# EAGLE board source_eagle (EAGLE 9.6.2)
REV: C
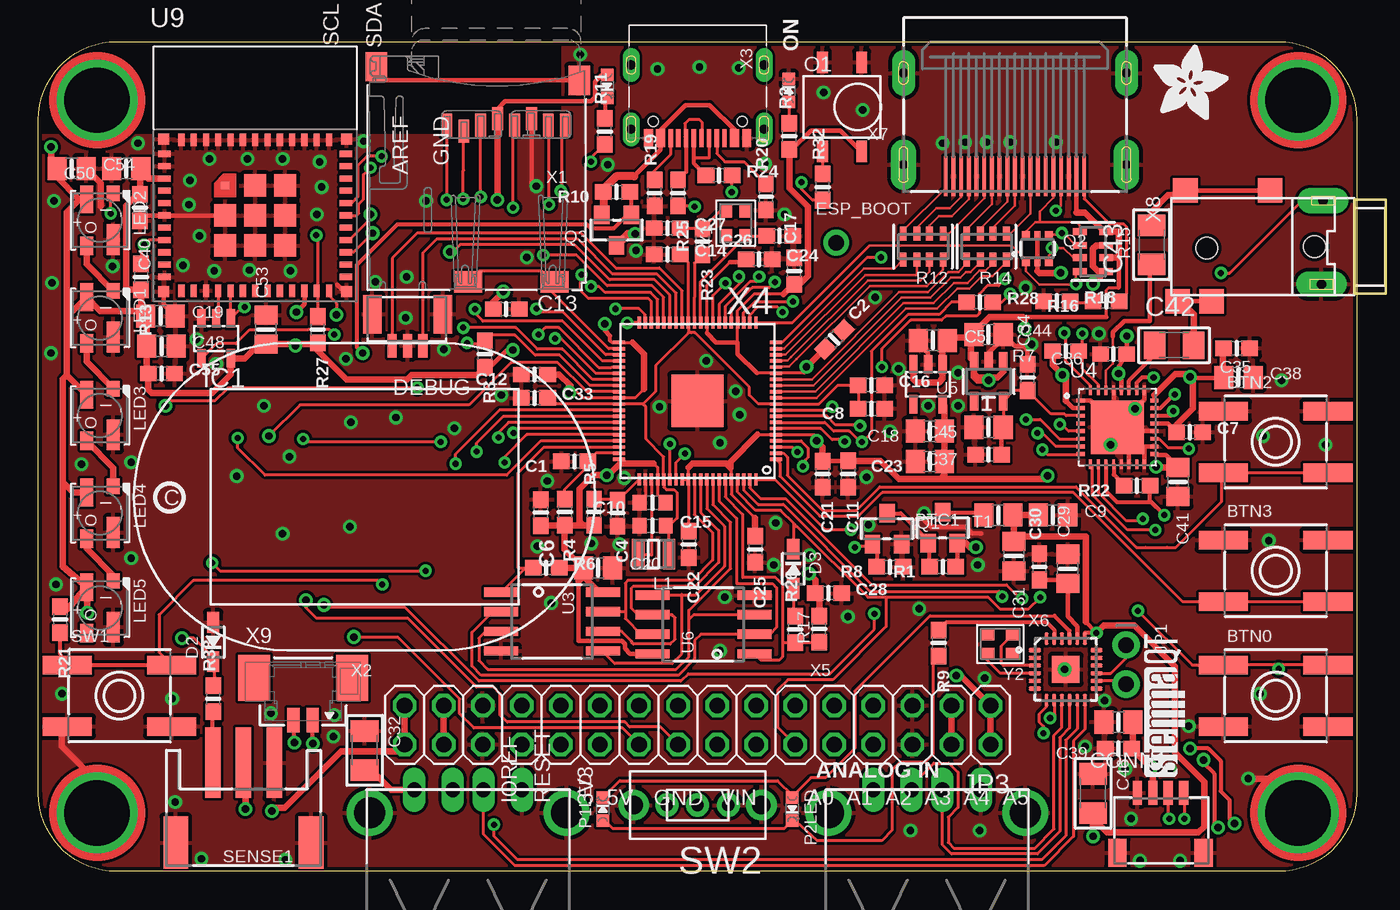
[diagram p2: board, top side]
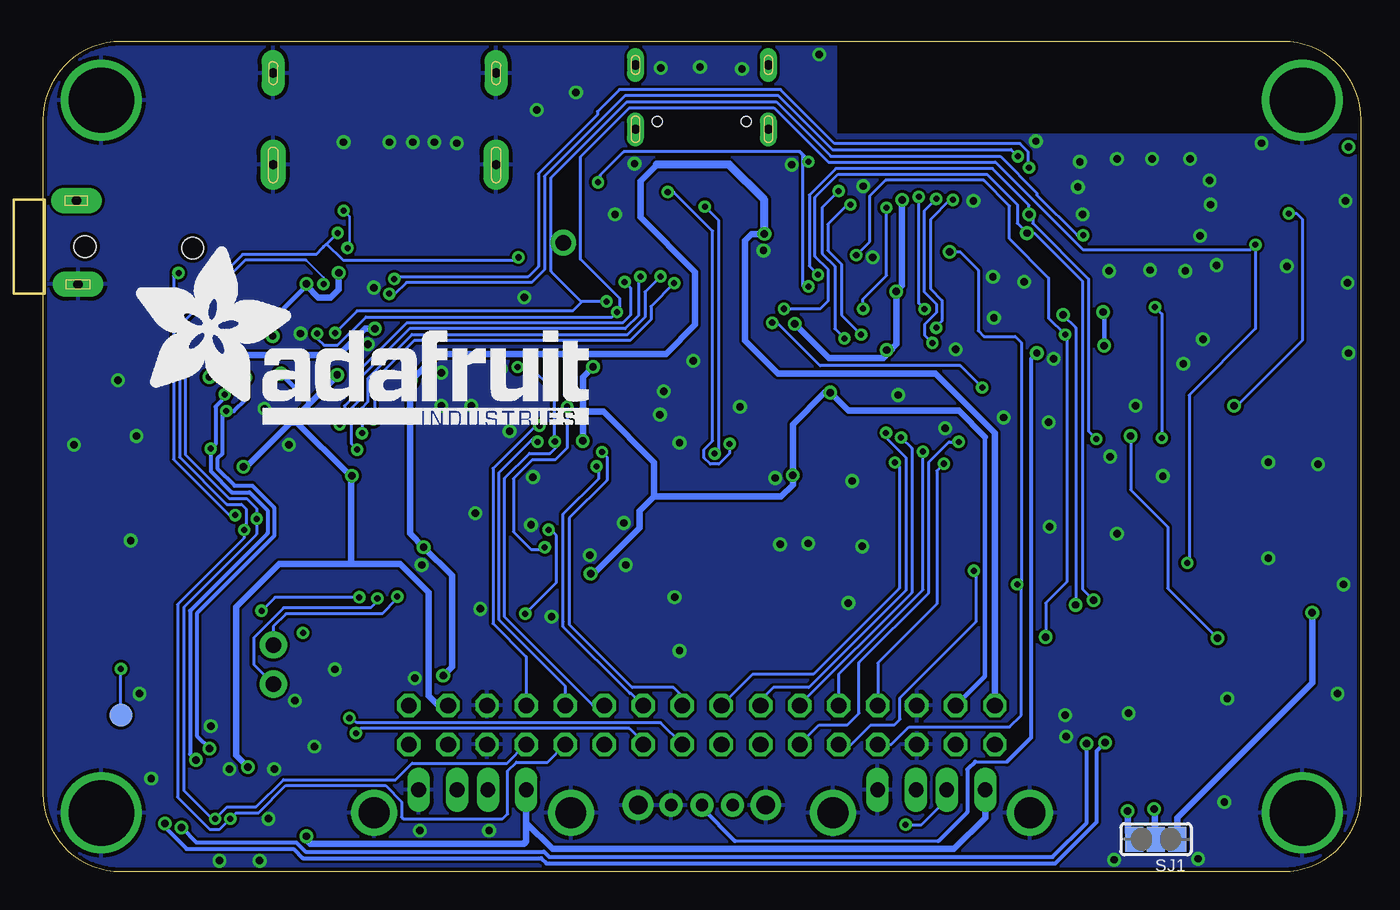
[diagram p3: board, bottom side, seen from below]

Size 85.72 x 53.98 mm. Coordinates in mm from the lower left corner, seen from the top.
Outline: 5.08,53.98 80.64,53.98 arc-90 85.72,48.9 85.72,5.08 arc-90 80.64,0 5.08,0 arc-90 0,5.08 0,48.9 arc-90 5.08,53.98
Copper layers (1*16): Top 0.035mm / dielectric 1.5mm / Bottom 0.035mm
Design rules "adafruit 7-7": minimum track width 7mil, minimum drill 15.5mil, track to track 7mil, track to pad 7mil, pad to pad 7mil, via to via 7mil, smd to smd 7mil, copper to edge 10mil, drill to drill 8mil, minimum pad ring 10mil, minimum via ring 8mil, stop-mask expansion 2mil, vias tented up to drill 20mil, thermal gap 10mil
Net classes: 3 Power: width 0.305 mm, drill 0.483 mm; 4 LOWPOWER: width 0.254 mm

## Footprints (pad centres in the part's own frame; a part is rotated, then mirrored left to right if it is on the bottom)
EVQ-Q2 = smd 3.2 x 1.2: A -3.4,-2; A' 3.4,-2; B -3.4,2; B' 3.4,2
0603-NO = smd 1.075 x 1: 1 -0.85,0; 2 0.85,0
0805-NO = smd 1.24 x 1.5: 1 -0.95,0; 2 0.95,0
0603-NO_WIDE = smd 0.9 x 1: 1 -0.85,0; 2 0.85,0
_1206 = smd 1.4 x 1.8: 1 -1.27,0; 2 1.27,0
JST_SH4 = smd 0.6 x 1.55: 1 -1.5,2.006; 2 -0.5,2.006; 3 0.5,2.006; 4 1.5,2.006 | smd 1.2 x 1.8: MT1 -2.8,-1.894; MT2 2.8,-1.894
SOD-323 = smd 1.35 x 0.8: A 1.27,0; C -1.27,0
JST_SH3_RA = smd 0.6 x 1.55: 1 1,0.924; 2 0,0.924; 3 -1,0.924 | smd 1.2 x 2.5: MT1 -2.3,-1.124; MT2 2.3,-1.124
1X01_ROUND = drill 1 pad 1.676: 1 0,0
SOT23-5L = smd 0.55 x 1.2: 1 -0.95,-1.3; 2 0,-1.3; 3 0.95,-1.3; 4 0.95,1.3; 5 -0.95,1.3
1X02_ROUND = drill 1 pad 1.778: 1 -1.27,0; 2 1.27,0
2X16 = drill 1.016 octagon: 1 -19.05,-1.27; 2 -19.05,1.27; 3 -16.51,-1.27; 4 -16.51,1.27; 5 -13.97,-1.27; 6 -13.97,1.27; 7 -11.43,-1.27; 8 -11.43,1.27; 9 -8.89,-1.27; 10 -8.89,1.27; 11 -6.35,-1.27; 12 -6.35,1.27; 13 -3.81,-1.27; 14 -3.81,1.27; 15 -1.27,-1.27; 16 -1.27,1.27; 17 1.27,-1.27; 18 1.27,1.27; 19 3.81,-1.27; 20 3.81,1.27; 21 6.35,-1.27; 22 6.35,1.27; 23 8.89,-1.27; 24 8.89,1.27; 25 11.43,-1.27; 26 11.43,1.27; 27 13.97,-1.27; 28 13.97,1.27; 29 16.51,-1.27; 30 16.51,1.27; 31 19.05,-1.27; 32 19.05,1.27
CHIPLED_0603_NOOUTLINE = smd 0.8 x 0.8: A 0,-0.75; C 0,0.75
INDUCTOR_1007 = smd 0.8 x 2: P$1 -1,0; P$2 1,0
LED3535_FULLPADS = smd 1 x 0.85: 1 -1.75,0.875 | smd 1.8 x 0.85: 2 -1.35,-0.875 | smd 1.2 x 0.85: 3 1.65,-0.875 | smd 2 x 0.85: 4 1.25,0.875
IRM-H6XXT = smd 0.7 x 1.4: 1 1.27,2.9; 2 -1.27,2.9; 3 -1.27,-2.9; 4 1.27,-2.9
SOT23-WIDE = smd 1 x 1.2: 1 -0.95,-1; 2 0.95,-1; 3 0,1
SOT363 = smd 0.5 x 0.5: 1 -0.75,-0.9; 3 0.75,-0.9; 4 0.75,0.9; 6 -0.75,0.9 | smd 0.4 x 0.5: 2 0,-0.9; 5 0,0.9
RESPACK_4X0603 = smd 0.45 x 0.9: 1 -1.3,-0.85; 2 -0.4,-0.85; 3 0.4,-0.85; 4 1.3,-0.85; 5 1.3,0.85; 6 0.4,0.85; 7 -0.4,0.85; 8 -1.3,0.85
JSTPH3 = smd 1 x 4.6: 1 -2,-2.7; 2 0,-2.7; 3 2,-2.7 | smd 1.6 x 3.4: NC1 -4.4,2.5; NC2 4.4,2.5
SOLDERJUMPER_2WAY_OPEN_NOPASTE = smd 1.168 x 1.6: 1 -1.397,0; 2 0,0; 3 1.397,0
SPDT_SS12D07VG5 = drill 1.2 pad 2: MNT1 4.15,0; MNT2 -4.15,0 | drill 0.8 pad 1.5: P 0,0; T1 -2,0; T2 2,0
TESTPOINT_ROUND_1.5MM_NO = smd 1.5 x 1.5: P$1 0,0
SMT_NUT_3MM = drill 4.25 pad 4.572: P$1 0,0
SOT23-DBV = smd 0.55 x 1.2: 1 -0.95,-1.3; 2 0,-1.3; 3 0.95,-1.3; 4 0.95,1.3; 5 -0.95,1.3
SOIC8_208MIL = smd 0.6 x 2.2: 1 -1.905,-3.315; 2 -0.635,-3.315; 3 0.635,-3.315; 4 1.905,-3.315; 5 1.905,3.315; 6 0.635,3.315; 7 -0.635,3.315; 8 -1.905,3.315
TLV320DAC3100 = smd 0.6 x 0.25: 1 -2.4,1.75; 2 -2.4,1.25; 3 -2.4,0.75; 4 -2.4,0.25; 5 -2.4,-0.25; 6 -2.4,-0.75; 7 -2.4,-1.25; 8 -2.4,-1.75; 17 2.4,-1.75; 18 2.4,-1.25; 19 2.4,-0.75; 20 2.4,-0.25; 21 2.4,0.25; 22 2.4,0.75; 23 2.4,1.25; 24 2.4,1.75 | smd 0.25 x 0.6: 9 -1.75,-2.4; 10 -1.25,-2.4; 11 -0.75,-2.4; 12 -0.25,-2.4; 13 0.25,-2.4; 14 0.75,-2.4; 15 1.25,-2.4; 16 1.75,-2.4; 25 1.75,2.4; 26 1.25,2.4; 27 0.75,2.4; 28 0.25,2.4; 29 -0.25,2.4; 30 -0.75,2.4; 31 -1.25,2.4; 32 -1.75,2.4 | smd 3.45 x 3.45: 33 0,0
SOT23-5 = smd 0.55 x 1.2: 1 -0.95,-1.3; 2 0,-1.3; 3 0.95,-1.3; 4 0.95,1.3; 5 -0.95,1.3
ESP32-PICO-MINI = smd 0.8 x 0.4: 1 -5.9,4; 2 -5.9,3.2; 3 -5.9,2.4; 4 -5.9,1.6; 5 -5.9,0.8; 6 -5.9,0; 7 -5.9,-0.8; 8 -5.9,-1.6; 9 -5.9,-2.4; 10 -5.9,-3.2; 11 -5.9,-4; 25 5.9,-4; 26 5.9,-3.2; 27 5.9,-2.4; 28 5.9,-1.6; 29 5.9,-0.8; 30 5.9,0; 31 5.9,0.8; 32 5.9,1.6; 33 5.9,2.4; 34 5.9,3.2; 35 5.9,4 | smd 0.4 x 0.8: 12 -4.8,-4.9; 13 -4,-4.9; 14 -3.2,-4.9; 15 -2.4,-4.9; 16 -1.6,-4.9; 17 -0.8,-4.9; 18 0,-4.9; 19 0.8,-4.9; 20 1.6,-4.9; 21 2.4,-4.9; 22 3.2,-4.9; 23 4,-4.9; 24 4.8,-4.9; 36 4.8,4.9; 37 4,4.9; 38 3.2,4.9; 39 2.4,4.9; 40 1.6,4.9; 41 0.8,4.9; 42 0,4.9; 43 -0.8,4.9; 44 -1.6,4.9; 45 -2.4,4.9; 46 -3.2,4.9; 47 -4,4.9; 48 -4.8,4.9 | smd 1.45 x 1.45: 49 0,0; 54 -1.95,0; 55 -1.95,-1.95; 56 0,-1.95; 57 1.95,-1.95; 58 1.95,0; 59 1.95,1.95; 60 0,1.95 | smd 0.7 x 0.7: 50 5.95,4.95; 51 5.95,-4.95; 52 -5.95,-4.95; 53 -5.95,4.95 | smd 0.5 x 0.5: 61 -1.95,1.95
MICROSD = smd 0.7 x 1.5: 1 1.761,-3.147; 2 0.661,-2.747; 3 -0.439,-3.147; 4 -1.539,-3.547; 5 -2.639,-3.147; 6 -3.739,-3.547; 7 -4.839,-3.147; 8 -5.939,-3.147 | smd 1.8 x 1.4: CD1 -5.239,7.053; CD2 0.38,7.053 | smd 1.4 x 1.9: MT1 -6.839,-6.047; MT2 6.361,-6.947
USB_TYPE_A_THM_SHORT = drill 0.95 long: D+ 1,1.5; D- -1,1.5; GND 3.5,1.5; VBUS -3.5,1.5 | drill 2 pad 3: S1 -6.4,0; S2 6.4,0
USB_C_CUSB31-CFM2AX-01-X = smd 0.575 x 1.15: A1B12 -3.2,2.275; A4B9 -2.4,2.275; B1A12 3.2,2.275; B4A9 2.4,2.275 | smd 0.275 x 1.15: A5 -1.25,2.275; A6 -0.25,2.275; A7 0.25,2.275; A8 1.25,2.275; B5 1.75,2.275; B6 0.75,2.275; B7 -0.75,2.275; B8 -1.75,2.275 | drill 0.6 pad 1 long: M1 -4.32,1.7; M2 4.32,1.7; M3 -4.32,-2.48; M4 4.32,-2.48 | hole 0.65: 2.89,1.2; -2.89,1.2
QFN80 = smd 0.78 x 0.22: 1 -5.09,3.8; 2 -5.09,3.4; 3 -5.09,3; 4 -5.09,2.6; 5 -5.09,2.2; 6 -5.09,1.8; 7 -5.09,1.4; 8 -5.09,1; 9 -5.09,0.6; 10 -5.09,0.2; 11 -5.09,-0.2; 12 -5.09,-0.6; 13 -5.09,-1; 14 -5.09,-1.4; 15 -5.09,-1.8; 16 -5.09,-2.2; 17 -5.09,-2.6; 18 -5.09,-3; 19 -5.09,-3.4; 20 -5.09,-3.8; 41 5.1,-3.8; 42 5.1,-3.4; 43 5.1,-3; 44 5.1,-2.6; 45 5.1,-2.2; 46 5.1,-1.8; 47 5.1,-1.4; 48 5.1,-1; 49 5.1,-0.6; 50 5.1,-0.2; 51 5.1,0.2; 52 5.1,0.6; 53 5.1,1; 54 5.1,1.4; 55 5.1,1.8; 56 5.1,2.2; 57 5.1,2.6; 58 5.1,3; 59 5.1,3.4; 60 5.1,3.8 | smd 0.22 x 0.78: 21 -3.8,-5.1; 22 -3.4,-5.1; 23 -3,-5.1; 24 -2.6,-5.1; 25 -2.2,-5.1; 26 -1.8,-5.1; 27 -1.4,-5.1; 28 -1,-5.1; 29 -0.6,-5.1; 30 -0.2,-5.1; 31 0.2,-5.1; 32 0.6,-5.1; 33 1,-5.1; 34 1.4,-5.1; 35 1.8,-5.1; 36 2.2,-5.1; 37 2.6,-5.1; 38 3,-5.1; 39 3.4,-5.1; 40 3.8,-5.1; 61 3.8,5.1; 62 3.4,5.1; 63 3,5.1; 64 2.6,5.1; 65 2.2,5.1; 66 1.8,5.1; 67 1.4,5.1; 68 1,5.1; 69 0.6,5.1; 70 0.2,5.1; 71 -0.2,5.1; 72 -0.6,5.1; 73 -1,5.1; 74 -1.4,5.1; 75 -1.8,5.1; 76 -2.2,5.1; 77 -2.6,5.1; 78 -3,5.1; 79 -3.4,5.1; 80 -3.8,5.1 | smd 3.4 x 3.4: MNT 0,0
QFN24_4MM = smd 0.8 x 0.28: 1 -2,1.25; 2 -2,0.75; 3 -2,0.25; 4 -2,-0.25; 5 -2,-0.75; 6 -2,-1.25; 13 2,-1.25; 14 2,-0.75; 15 2,-0.25; 16 2,0.25; 17 2,0.75; 18 2,1.25 | smd 0.28 x 0.8: 7 -1.25,-2; 8 -0.75,-2; 9 -0.25,-2; 10 0.25,-2; 11 0.75,-2; 12 1.25,-2; 19 1.25,2; 20 0.75,2; 21 0.25,2; 22 -0.25,2; 23 -0.75,2; 24 -1.25,2 | smd 1.778 x 1.778: THERM 0,0
HDMI_MOLEX_47151-0001 = smd 0.25 x 2.6: 1 4.5,3.302; 2 4,3.302; 3 3.5,3.302; 4 3,3.302; 5 2.5,3.302; 6 2,3.302; 7 1.5,3.302; 8 1,3.302; 9 0.5,3.302; 10 0,3.302; 11 -0.5,3.302; 12 -1,3.302; 13 -1.5,3.302; 14 -2,3.302; 15 -2.5,3.302; 16 -3,3.302; 17 -3.5,3.302; 18 -4,3.302; 19 -4.5,3.302 | drill 0.6 pad 1.65 long: P$1 -7.25,2.542; P$2 7.25,2.542 | drill 0.6 pad 1.5 long: P$3 7.25,-3.418; P$4 -7.25,-3.418
PJ-332A = drill 0.6 pad 1.651 long: 1 -4.792,-3; 2 -4.692,2.45 | smd 1.6 x 1.6: 3 -1.342,-3.65; 4 2.458,3.55; 5 4.158,-3.65; 6 4.658,3.55 | hole 1.4: -4.242,0; 2.758,0.1
53398-0271 = smd 0.8 x 1.6: 1 0.625,-1.27; 2 -0.625,-1.27 | smd 2.1 x 3: M1 3.185,1.48; M2 -3.185,1.48
CRYSTAL_2.5X2 = smd 0.9 x 0.75: 1 -0.825,-0.625; 2 0.825,-0.625; 3 0.825,0.625; 4 -0.825,0.625

## Placement (x,y rotation side)
BTN0  6MM_TACT  [EVQ-Q2]  80.45,11.43 0 top
BTN2  6MM_TACT  [EVQ-Q2]  80.45,27.94 0 top
BTN3  6MM_TACT  [EVQ-Q2]  80.45,19.56 0 top
C1  2.2uF  [0603-NO]  34.86,26.67 180 top
C2  1uF  [0603-NO]  51.75,34.61 45 top
C3  10uF  [0805-NO]  70.23,9.72 0 top
C4  2.2uF  [0603-NO]  37.66,23.3 270 top
C5  10uF  [0805-NO]  58.17,34.54 0 top
C6  0.1uF  [0603-NO]  32.66,23.34 270 top
C7  0.1uF  [0603-NO]  74.87,28.57 0 top
C8  0.1uF  [0603-NO]  54.17,30.1 180 top
C9  10uF  [0805-NO]  65.98,23.18 0 top
C10  10uF_0603  [0603-NO_WIDE]  39.93,23.99 180 top
C11  1uF  [0603-NO]  52.65,25.85 270 top
C12  1uF  [0603-NO]  32.26,32.32 180 top
C13  0.1uF  [0603-NO]  30.42,36.58 0 top
C14  0.1uF  [0603-NO]  40.89,40.13 0 top
C15  10uF_0603  [0603-NO_WIDE]  39.94,22.48 0 top
C16  1uF  [0603-NO]  54.17,31.62 0 top
C17  0.1uF  [0603-NO]  49.15,39.05 90 top
C18  10uF  [0805-NO]  57.98,28.64 180 top
C19  10uF  [0805-NO]  7.94,36.13 0 top
C20  10uF  [0805-NO]  36.39,19.75 0 top
C21  0.1uF  [0603-NO]  50.99,25.84 270 top
C22  0.1uF  [0603-NO]  42.29,21.27 270 top
C23  10uF  [0805-NO]  57.98,26.67 180 top
C24  0.1uF  [0603-NO]  46.86,39.81 0 top
C25  0.1uF  [0603-NO]  46.61,20.95 270 top
C26  15pF  [0603-NO]  48.2,41.34 180 top
C27  15pF  [0603-NO]  40.89,41.85 0 top
C28  1uF  [0603-NO]  51.37,18.1 0 top
C29  10uF  [0805-NO]  66.93,19.68 90 top
C30  1uF  [0603-NO]  65.09,19.81 90 top
C31  10uF  [0805-NO]  63.44,20.51 270 top
C32  100uF/6.3V  [_1206]  21.21,7.87 270 top
C33  0.1uF  [0603-NO]  32.26,30.8 0 top
C34  0.1uF  [0603-NO]  64.33,32.13 90 top
C35  0.1uF  [0603-NO]  77.91,34.04 180 top
C36  0.1uF  [0603-NO]  69.91,33.66 180 top
C37  0.1uF  [0603-NO]  61.79,27.11 180 top
C38  10uF  [0805-NO]  78.04,32.13 0 top
C39  0.1uF  [0603-NO]  70.23,8 180 top
C40  0.1uF  [0603-NO]  6.6,43.18 270 top
C41  10uF  [0805-NO]  74.1,25.34 270 top
C42  100uF/6.3V  [_1206]  73.85,34.23 0 top
C43  100uF/6.3V  [_1206]  72.39,40.77 90 top
C44  10uF  [0805-NO]  61.79,34.92 0 top
C45  10uF  [0805-NO]  61.79,28.89 180 top
C46  100uF/6.3V  [_1206]  68.58,5.08 270 top
C48  10uF  [0805-NO]  8,34.16 0 top
C50  10uF  [0805-NO]  5.71,45.72 180 top
C53  10uF  [0805-NO]  14.8,35.24 90 top
C54  10uF  [0805-NO]  2.16,45.72 0 top
C55  1uF  [0603-NO]  8,32.38 0 top
CONN1  STEMMA_I2C_QT  [JST_SH4]  72.96,3.11 0 top
D2  3.6V  [SOD-323]  11.37,14.92 90 top
D3  1N4148  [SOD-323]  49.09,19.68 270 top
DEBUG  JST_SH3  [JST_SH3_RA]  24,35.12 180 top
ESP_BOOT  [1X01_ROUND]  51.88,40.89 0 top
IC1  74AHC1G125  [SOT23-5L]  11.56,34.67 180 top
JP1  [1X02_ROUND]  70.74,13.46 270 top
JP3  2x16 SOCKET  [2X16]  42.86,9.53 180 top
L  RED  [CHIPLED_0603_NOOUTLINE]  36.98,51.05 180 top
L1  DFE252012F-3R3M=P2  [INDUCTOR_1007]  40.01,20.64 180 top
LED1  WS2812B_3535FULL  [LED3535_FULLPADS]  4,36 270 top
LED2  WS2812B_3535FULL  [LED3535_FULLPADS]  4,42.35 270 top
LED3  WS2812B_3535FULL  [LED3535_FULLPADS]  4,29.65 270 top
LED4  WS2812B_3535FULL  [LED3535_FULLPADS]  4,23.3 270 top
LED5  WS2812B_3535FULL  [LED3535_FULLPADS]  4,17.14 270 top
O1  GENERIC_IR_RECV_IRM-H6XXT  [IRM-H6XXT]  52.26,49.72 0 top
ON  GREEN  [CHIPLED_0603_NOOUTLINE]  48.79,50.8 0 top
P1LED  GREEN  [CHIPLED_0603_NOOUTLINE]  36.7,4.06 0 top
P2LED  GREEN  [CHIPLED_0603_NOOUTLINE]  49.02,4.06 180 top
PLABEL0  [PLABEL0]  49.02,52.83 0 top
PLABEL1  [PLABEL1]  36.96,53.02 0 top
PLABEL2  [PLABEL2]  73.79,47.18 0 top
PLABEL3  [PLABEL3]  16.26,15.88 0 top
PLABEL4  [PLABEL4]  80.64,23.94 0 top
PLABEL5  [PLABEL5]  80.84,15.56 0 top
PLABEL6  [PLABEL6]  80.58,7.56 0 top
PLABEL7  [PLABEL7]  77.34,1.33 90 top
PLABEL8  [PLABEL8]  5.21,7.68 0 top
PLABEL9  [PLABEL9]  23.75,13.21 90 top
PLABEL10  [PLABEL10]  26.29,13.14 90 top
PLABEL11  [PLABEL11]  28.83,12.83 0 top
PLABEL12  [PLABEL12]  31.69,12.89 0 top
PLABEL13  [PLABEL13]  34.04,12.89 0 top
PLABEL14  [PLABEL14]  36.58,12.89 0 top
PLABEL15  [PLABEL15]  39.18,12.83 0 top
PLABEL16  [PLABEL16]  41.66,12.83 0 top
PLABEL17  [PLABEL17]  44.26,12.83 0 top
PLABEL18  [PLABEL18]  46.86,12.83 0 top
PLABEL19  [PLABEL19]  49.28,12.83 0 top
PLABEL20  [PLABEL20]  51.82,12.89 0 top
PLABEL21  [PLABEL21]  53.98,12.89 0 top
PLABEL22  [PLABEL22]  56.83,12.83 0 top
PLABEL23  [PLABEL23]  59.63,12.83 0 top
PLABEL24  [PLABEL24]  62.1,12.83 0 top
PLABEL25  [PLABEL25]  45.85,0.95 0 top
PLABEL26  [PLABEL26]  39.94,0.95 0 top
PLABEL27  [PLABEL27]  22.99,16 0 top
PLABEL28  [PLABEL28]  21.27,24.7 0 top
PLABEL29  [PLABEL29]  23.24,32.64 0 top
PLABEL30  [PLABEL30]  63.56,43.12 0 top
PLABEL31  [PLABEL31]  76.14,11.49 90 top
PLABEL32  [PLABEL32]  1.02,29.46 90 top
PLABEL33  [PLABEL33]  7.24,1.4 90 top
PLABEL34  [PLABEL34]  53.47,45.34 0 top
PLABEL35  [PLABEL35]  29.02,53.21 0 top
PLABEL36  [PLABEL36]  0.95,27.24 0 bottom
PLABEL37  [PLABEL37]  63.75,21.65 0 bottom
PLABEL38  [PLABEL38]  15.88,1.21 90 bottom
PLABEL39  [PLABEL39]  9.65,1.21 90 bottom
PLABEL40  [PLABEL40]  14.99,3.49 0 bottom
PTC1  5V/1A  [0805-NO]  62.42,23.18 180 top
Q1  BSS138  [SOT23-WIDE]  55.18,22.29 0 top
Q2  BSS138 Dual  [SOT363]  64.96,40.51 0 top
Q3  DMP3098L  [SOT23-WIDE]  37.59,41.72 180 top
R1  10K  [0603-NO]  58.8,19.81 180 top
R2  10K  [0603-NO]  48.83,47.82 90 top
R3  10K  [0603-NO]  29.02,33.66 270 top
R4  220  [0603-NO]  34.23,23.37 270 top
R5  22 ohm  [0603-NO]  36.13,23.37 90 top
R6  10K  [0603-NO]  33.02,19.75 0 top
R7  10K  [0603-NO]  66.8,33.85 180 top
R8  10K  [0603-NO]  55.37,19.81 180 top
R9  5.1K  [0603-NO]  58.55,14.86 270 top
R10  10K  [0603-NO]  37.59,44.2 180 top
R11  2.2K  [0603-NO]  36.83,48.13 90 top
R12  220 Pack  [RESPACK_4X0603]  57.53,40.64 180 top
R13  10K  [0603-NO]  6.67,38.67 270 top
R14  220 Pack  [RESPACK_4X0603]  61.66,40.64 180 top
R15  10K Pack  [RESPACK_4X0603]  68.58,40.32 270 top
R16  100K  [0603-NO]  69.43,37.08 180 top
R17  10K  [0603-NO]  50.77,15.77 90 top
R18  100K  [0603-NO]  66.23,37.08 0 top
R19  5.1K  [0603-NO]  40.07,44.13 90 top
R20  5.1K  [0603-NO]  47.31,43.88 90 top
R21  10K  [0603-NO]  1.4,16.38 270 top
R22  2.2K  [0603-NO]  71.44,25.08 180 top
R23  1K  [0603-NO]  43.18,40.96 270 top
R24  22 ohm  [0603-NO]  44.26,45.28 0 top
R25  22 ohm  [0603-NO]  41.59,44.13 270 top
R26  1K  [0603-NO]  49.21,15.75 90 top
R27  10K  [0603-NO]  18.16,35.24 270 top
R28  2.2K  [0603-NO]  61.21,37.02 0 top
R32  10K  [0603-NO]  50.99,44.51 90 top
R38  1K  [0603-NO]  11.37,11.24 90 top
SENSE1  JST PH 3  [JSTPH3]  13.34,4.38 180 top
SJ1  [SOLDERJUMPER_2WAY_OPEN_NOPASTE]  13.34,2.1 180 bottom
SW1  6MM_TACT  [EVQ-Q2]  5.27,11.43 0 top
SW2  SS12D07VG5  [SPDT_SS12D07VG5]  42.86,4.32 180 top
T1  DMP3098L  [SOT23-WIDE]  58.8,22.35 0 top
TP1  [TESTPOINT_ROUND_1.5MM_NO]  80.64,10.16 0 bottom
TP2  DNP  [SMT_NUT_3MM]  3.81,50.16 0 top
TP3  SEWTAP_SMTNUTM3  [SMT_NUT_3MM]  81.92,50.16 0 top
TP4  SEWTAP_SMTNUTM3  [SMT_NUT_3MM]  81.92,3.81 0 top
TP5  SEWTAP_SMTNUTM3  [SMT_NUT_3MM]  3.81,3.81 0 top
U2  AP2112K-3.3  [SOT23-DBV]  57.85,31.69 180 top
U3  AP6404  [SOIC8_208MIL]  33.4,16.26 270 top
U4  TLV320DAC3100  [TLV320DAC3100]  70.17,28.89 0 top
U5  AP2127K-1.8  [SOT23-5]  61.79,31.88 180 top
U6  W25Q128  [SOIC8_208MIL]  43.24,16.07 90 top
U9  ESP32-C6-MINI_MINI  [ESP32-PICO-MINI]  14.1,42.67 0 top
U$72  [ADAFRUIT_5MM]  72.52,48.9 0 top
U$73  [SPEAKER_OVAL8OHM]  21.21,24.38 0 top
U$86  [STEMMAQT]  74.55,6.16 90 top
U$87  [PCBFEAT-REV-040]  8.51,24.32 0 top
U$114  [ADAFRUIT_TEXT_30MM]  79.88,29.08 0 bottom
X1  MICROSD  [MICROSD]  28.32,45.4 180 top
X2  USB_TYPEA  [USB_TYPE_A_THM_SHORT]  27.94,3.81 0 top
X3  USB Type C  [USB_C_CUSB31-CFM2AX-01-X]  42.86,49.97 180 top
X4  RP2350B  [QFN80]  42.86,30.61 180 top
X5  USB_TYPEA  [USB_TYPE_A_THM_SHORT]  57.78,3.81 0 top
X6  CH334F  [QFN24_4MM]  66.8,13.14 0 top
X7  47151-0001  [HDMI_MOLEX_47151-0001]  63.5,48.51 180 top
X8  TRRS_2SWITCH_PJ332A  [PJ-332A]  78.74,40.64 180 top
X9  CON_MOLEX_2P  [53398-0271]  17.21,11.11 0 top
Y1  12MHz_10pF_50ohm  [CRYSTAL_2.5X2]  45.34,42.16 90 top
Y2  12MHz  [CRYSTAL_2.5X2]  62.55,14.8 180 top

## Tracks (layer width: path | path; a pad name or v marks a point on that pad's centre or on a via)
1.2V
  Top 0.203: C14.2 42.26,39.61 X4.32 42.26,35.05 | 40.89,22.48 41.02,22.48 41.53,22.99 41.53,24.64 41.33,24.84 40.84,24.84 40.67,25 40.67,25.5 X4.65 40.66,26.96 39.5,28.13 39.5,30.23 39.32,30.41 | 40.89,22.48 C15.2 | L1.P$1 41.01,22.37 40.89,22.48 | C8.2 C16.1 51.98,31.62 50.77,30.41 X4.10 46.81,30.41 46.23,30.99 46.23,31.5 42.69,35.04 42.44,35.04 42.42,35.05 42.26,35.05 | 39.32,30.41 X4.51 33.5,30.41 C33.2 | 42.26,35.05 42.26,35.02 40.13,32.89 40.13,31.22 39.32,30.41
1.8V
  Top 0.203: U4.3 66.82,29.64 66.7,29.76 65.84,29.76 C34.1 63.44,31.28 U5.5 C45.1
  Top 0.305: C37.1 62.64,28.79 C45.1
3.3V  (via drill 0.48)
  Top 0.203: 44.96,39.62 43.46,38.13 X4.29 43.46,35.02 | 48.45,37.57 46.55,37.57 45.46,36.48 X4.24 45.46,34.42 | 46.61,22.99 45.06,24.53 X4.76 45.06,26.18 44.99,26.26 | X4.68 X4.69 | X4.69 42.26,22.15 | C10.1 40.26,24.51 X4.64 40.26,26.29 40.01,26.54 | 37.76,26.46 X4.60 38.03,26.54 | X4.69 42.26,26.26 | 38.62,34.41 X4.41 37.28,34.41 37.18,34.51 | 39.37,31.37 38.81,30.81 X4.50 35.4,30.81 33.89,32.32 | 46.71,32.41 X4.15 49.81,32.41 49.94,32.54 | 46.76,28.41 X4.5 50.44,28.41 50.61,28.23
  Top 0.254: 37.18,34.51 37.18,34.83 | 50.61,28.23 v50.61,28
  Top 0.305: C24.1 45.82,39.62 44.96,39.62 | C11.1 51,26.7 C21.1 | 42.26,22.15 C22.1 | 35.12,18.88 35.12,14.98 37.95,14.98 38.15,14.79 38.15,14.49 38.48,14.16 U6.8 | U4.17 72.63,27.08 73.31,27.08 C41.1 | U4.2 67.27,30.14 66.8,30.61 | 46.71,32.41 45.46,33.66 45.46,34.42 44.07,34.42 43.46,35.02 | 33.89,32.32 33.87,32.32 | 33.15,32.32 C12.1 | 37.18,34.83 36.83,35.18 v36.83,35.62 | R3.2 29.37,32.8 30.48,33.91 v30.86,33.91 | U4.28 70.42,32.22 v70.25,32.38 70.25,32.84 C36.1 70.78,33.67 v70.78,34.82 | 64.96,39.05 Q2.2 Q2.5 | O1.4 52.15,48.2 50.23,48.2 49,46.97 R2.1 | L.A 36.63,51.8 36.19,51.37 36.19,50.36 35.93,50.1 30.35,50.1 29.84,49.59 29.84,48.97 X1.4 | U9.22 17.3,36.92 v16.76,36.39 | v16.7,34.2 16.7,34.29 | v49.94,32.83 49.94,32.54
  Top 0.406: R15.7 68.79,40.72 68.58,40.51 68.58,39.37 68.93,39.02 R15.5 69.38,39.02 v68.58,38.23 | 48.45,37.57 49.09,38.2 C17.1 49.53,38.2 50.04,38.71 50.04,43.24 48.83,44.45 R2.1 | C25.1 46.61,22.99 | R5.1 35.43,22.52 | 35.43,22.52 R4.2 | 35.43,22.52 35.18,22.77 35.18,24.89 36.07,25.78 v36.96,25.78 37.08,25.78 37.76,26.46 | U3.8 36.65,18.22 36.41,18.22 35.44,19.2 | 42.26,26.26 42.55,26.54 44.7,26.54 44.99,26.26 44.99,26.64 46.76,28.41 | 38.03,26.54 40.01,26.54 | C41.1 72.68,26.29 v72.68,26.33 | 66.8,30.61 66.8,32.08 v66.58,32.29 65.95,32.93 R7.2 | 1.84,36.07 LED1.2 4.03,36.45 6.67,36.45 C19.1 | 1.84,32.29 LED3.2 | 1.84,36.07 1.84,32.29 | LED4.2 2.27,24.65 1.59,25.34 | 1.59,25.34 1.59,32.03 1.84,32.29 | LED5.2 1.59,19.84 1.59,25.34 | 38.62,34.41 39.37,33.66 39.37,31.37 | X1.4 29.84,48.93 v29.84,43.69 | v30.23,37.72 30.23,37.68 29.57,37.02 C13.1 | C11.1 54.77,26.7 55.94,25.53 58.67,25.53 | 58.67,25.53 58.92,25.78 C23.1 C18.1 58.92,30.26 U2.5 | LED5.2 1.91,17.08 1.55,17.08 R21.1 | C21.1 50.99,27.62 v50.61,28 | v34.51,31.15 34.51,31.53 34.59,31.6 33.87,32.32 33.15,32.32 | 58.67,25.53 65.41,25.53 v65.63,25.74 | C3.2 71.18,8.1 C39.1 72.29,6.79 v72.39,6.79 72.46,6.72 CONN1.2 | v66.48,38.92 65.09,38.92 64.96,39.05 | 16.7,34.29 18.06,34.29 R27.2 18.16,33.88 20.04,32 23.96,32 24.26,32.3 28.51,32.3 R3.2 | C19.1 7.05,36.07 C48.1 7.05,32.48 C55.1 7.15,31.33 7.37,31.11 11.3,31.11 12.51,32.32 IC1.5 13.4,33.37 14.32,34.29 C53.1 16.61,34.29 v16.7,34.2 | C19.1 6.67,36.45 R13.2 6.64,37.85 5.71,37.85 5.71,43.31 6.44,44.03 C40.1 6.6,45.59 6.73,45.47 | LED2.2 2.65,43.7 | 2.65,43.7 1.14,45.21 1.14,45.65 C54.1 0.83,46.1 v0.83,47.12
  Top 0.406: C50.1 6.73,45.65 6.73,45.47 | U9.3 7.12,45.07 6.73,45.47 | JP3.30 JP3.29 | JP3.3 JP3.4 | 1.84,36.07 1.84,42.9 2.65,43.7 | C20.1 35.44,19.2 | 35.44,19.2 35.12,18.88 | C20.1 34.23,20.96 R4.2 | R6.2 C20.1 | C6.2 34.2,22.49 R4.2 | v3.17,16.83 3.17,18.45 LED5.2 | v50.1,19.37 50.52,18.95 C28.1 50.77,17.84 R17.2 | C2.1 49.97,32.83 v49.94,32.83
  Bottom 0.305: v70.25,32.38 68.39,30.52 | v30.86,33.91 30.54,33.91 30.51,33.94 30.54,33.97 | v70.78,34.82 70.78,35.9 68.58,38.1 | 24.45,28.26 24.45,12.7 JP3.29 | v16.7,34.2 16.7,36.32 v16.76,36.39
  Bottom 0.406: 45.97,24.38 37.72,24.38 36.96,25.15 v36.96,25.78 36.96,29.08 34.89,31.15 v34.51,31.15 33.34,29.97 26.16,29.97 24.45,28.26 | v72.68,26.33 72.47,26.33 69.6,29.21 | 69.6,29.21 68.39,30.42 | 68.39,30.42 66.55,32.26 v66.58,32.29 | 68.39,30.52 68.39,30.42 | 65.66,20 70.36,20 73.15,17.21 73.15,7.56 v72.39,6.79 | 65.66,20 65.66,25.65 65.88,25.88 | 69.6,29.21 69.22,29.21 65.88,25.88 | v50.1,19.37 49.91,19.37 46.93,22.35 46.93,23.43 45.97,24.38 | v29.84,43.69 29.84,38.1 v30.23,37.72 30.23,34.29 30.54,33.97 | v36.83,35.62 34.61,33.4 31.05,33.4 30.51,33.94 | v49.94,32.83 50.61,32.16 50.61,29.91 | 50.61,29.91 v50.61,28 | v65.63,25.74 65.76,25.88 65.88,25.88 | 45.97,24.38 45.97,26.61 49.28,29.91 50.61,29.91 | v68.58,38.23 68.58,38.1 67.82,37.34 66.99,37.34 66.48,37.85 v66.48,38.92 | JP3.3 60.01,10.79 60.64,11.43 60.64,18.16 62.48,20 65.66,20 | SJ1.1 11.94,3.49 3.17,12.26 v3.17,16.83
5.0V  (via drill 0.48)
  Top 0.203: 69.43,36.07 69.43,37.81 69.6,37.97 70.23,37.97
  Top 0.254: U4.24 72.57,30.98
  Top 0.305: 74.9,32.09 75.06,32.09 77.09,32.09 C38.1 | U4.21 73.45,29.14 C7.1 | T1.2 59.75,19.91 R1.1 | 59.31,34.73 C5.2 59.12,34.38 | X7.18 67.5,42.86 | 70.26,39.92 70.26,38 70.23,37.97 | 69.43,36.07 64.01,36.07
  Top 0.406: C38.1 76.99,32.25 C35.2 | 74.9,32.09 v74.9,32.16 74.71,32.35 73.95,32.35 72.57,30.98 | C7.1 74.02,29.07 75.06,30.11 75.06,32.09 | 60.65,34.73 60.65,33.37 U5.3 | U5.1 62.74,32.51 62.36,32.13 61.09,32.13 60.84,32.38 U5.3 | U5.3 60.84,32.16 61.06,31.94 v61.78,31.94 | T1.2 60.31,21.35 60.58,21.08 v60.96,21.08 | v64.14,35.31 64.14,35.94 64.01,36.07 61.85,36.07 60.84,35.05 C44.1 60.84,34.73 60.65,34.73 | U2.3 56.9,32 57.09,31.81 58.55,31.81 58.8,32.06 U2.1 58.8,34.07 59.12,34.38 | 59.31,34.73 60.65,34.73 | 67.5,42.86 68.06,42.86 69.3,41.62 R15.8 70.26,41.62 70.26,39.92 R15.6 | JP3.31 JP3.32 23.37,7.81 19.68,7.81 16,4.13 15.37,4.13 v15.18,3.94 | JP3.2 JP3.1 59.97,12.74 v59.69,12.74
  Top 0.508: v38.8,41.47 38.34,41.47 Q3.3
  Bottom 0.406: 45.79,45.98 46.86,44.91 46.86,42.55 43.31,38.99 43.31,35.56 45.21,33.66 60.07,33.66 v61.78,31.94 61.85,31.88 61.85,21.97 v60.96,21.08 59.12,19.24 59.12,13.31 v59.69,12.74 | v74.9,32.16 74.83,32.16 73.41,33.59 66.48,33.59 64.77,35.31 v64.14,35.31 | v38.8,41.47 39.62,41.47 40.07,41.02 40.07,34.54 37.91,32.38 27.69,32.38 23.81,28.51 JP3.31 | v15.18,3.94 15.18,2.54 SJ1.3
  Bottom 0.508: v38.8,41.47 38.8,43.69 41.09,45.98 45.79,45.98
!RESET  (via drill 0.39, 0.48)
  Top 0.203: X4.35 41.06,37.49 40.07,38.48 37.15,38.48 34.86,40.77 27.43,40.77 26.97,40.3 v26.75,40.3 | SW1.B' 7.84,14.26 7.84,16.69 10.08,18.92 22.1,18.92 v22.36,18.67
  Top 0.254: R21.2 1.4,14.15 SW1.B SW1.B'
  Bottom 0.203: v26.75,40.3 26.09,40.3 24.89,39.11 24.89,35.18 24.51,34.8 22.48,34.8 22.1,34.42 22.1,18.67 | JP3.26 30.54,8.26 29.4,9.4 22.86,9.4 22.1,10.16 22.1,18.67 | v22.36,18.67 22.1,18.67
A0  (via drill 0.48)
  Top 0.203: X4.49 35.67,31.21 33.77,33.1 30.75,33.1 28,30.35 17.02,30.35 v14.99,28.32 | v9.34,15.18 10.1,15.18 11.43,13.84 11.43,12.15 R38.2 11.5,12.13 D2.C
  Bottom 0.203: v14.99,28.32 14.99,24.83 12.57,22.42 12.57,18.41 v9.34,15.18
A0_JST1
  Top 0.254: R38.1 11.34,10.29 SENSE1.3
A1  (via drill 0.39)
  Top 0.203: X4.52 29.97,30.01 27.13,27.16 v27.13,26.52
  Bottom 0.203: v27.13,26.52 27.6,26.05 27.6,17.39 31.43,13.56 JP3.25
A2  (via drill 0.39)
  Top 0.203: X4.53 30.24,29.61 28.49,27.85 v28.49,27.3
  Bottom 0.203: v28.49,27.3 28.49,18.32 32.99,13.81 33.97,12.83 JP3.23
A3  (via drill 0.39)
  Top 0.203: X4.54 30.57,29.21 29.91,28.55 v29.91,28.23
  Bottom 0.203: v29.91,28.23 29.21,27.53 29.21,18.13 36.39,10.96 36.39,10.92 JP3.21
A4  (via drill 0.39)
  Top 0.203: X4.55 31.17,28.81 v30.89,28.53
  Bottom 0.203: v30.89,28.53 30.89,28.21 29.59,26.91 29.59,18.29 35.92,11.96 38.21,11.96 39.06,11.11 39.05,11.1 JP3.19
A5  (via drill 0.39)
  Top 0.203: X4.56 31.75,28.41 30.32,26.97 v30.32,26.61
  Bottom 0.203: v30.32,26.61 30.04,26.33 30.04,18.41 35.62,12.83 39.56,12.83 JP3.17
ADC_AVDD
  Top 0.203: X4.59 36.25,27.21 C1.1 35.71,26.34 34.23,24.85 R4.1
BUTTON2
  Top 0.203: BTN3.A' BTN3.A 74.39,17.56 71.12,20.83 71.03,20.92 67.31,24.64 54.86,24.64 53.34,23.11 50.81,23.11 48.21,25.72 48.21,26.55 X4.1
BUTTON3
  Top 0.203: X4.2 48.45,27.21 48.7,26.95 48.7,25.76 50.97,23.5 53.18,23.5 54.71,25.02 67.47,25.02 71.41,21.08 72.01,21.08 73.41,21.08 73.98,21.08 76.92,24.02 76.92,25.8 BTN2.A BTN2.A'
CC1
  Top 0.203: X3.A5 44.11,46.69 44.64,46.16 45.87,46.16 R20.2
CC2
  Top 0.203: X3.B5 41.11,46.64 39.76,45.29 R19.2
D6  (via drill 0.39)
  Top 0.203: X4.3 49.03,27.61 v49.36,27.28
  Bottom 0.203: v49.36,27.28 49.04,26.96 49.04,25.44 51.5,22.98 51.5,16.07 47.4,11.96 44.72,11.96 44.13,11.38 JP3.15
D7  (via drill 0.39)
  Top 0.203: X4.4 49.59,28.01 50.04,27.56 50.04,26.92 49.72,26.61 v49.72,26.35
  Bottom 0.203: v49.72,26.35 49.59,26.23 49.59,25.53 51.88,23.24 51.88,16.26 51.88,15.91 47.55,11.58 47.46,11.58 JP3.13
D8/TX1  (via drill 0.39)
  Top 0.203: v52.43,27.96 52.3,28.08 51.6,28.08 50.88,28.81 X4.6 | U9.30 20.7,42.67 20.83,42.8 20.83,43.4 21.14,43.72 21.14,45.34 v21.59,45.78 | v62.87,38.54 62.42,38.1 61.71,38.1 61.18,37.57 61.18,36.29 61.02,36.13 59.02,36.13 58.73,35.85 56.71,35.85 54.86,34 v54.86,32.81
  Bottom 0.203: JP3.11 49.94,10.79 55.69,16.54 55.69,25.58 54.08,27.19 52.75,27.19 52.37,27.57 52.37,27.89 v52.43,27.96 52.49,27.96 52.49,31.28 54.13,32.92 54.75,32.92 v54.86,32.81 | v21.59,45.78 21.64,45.83 21.64,46.8 22.18,47.34 34.23,47.34 37.75,50.86 48.23,50.86 49.66,49.43 49.66,49.21 53.49,45.38 53.49,39.34 54.14,38.7 62.72,38.7 v62.87,38.54
D9/RX1  (via drill 0.39)
  Top 0.203: X4.7 51.14,29.21 51.71,28.64 52.72,28.64 53.51,27.86 53.57,27.92 | 53.57,27.92 v53.55,27.94 | R28.1 59.37,37.02 58.58,36.23 56.55,36.23 54.17,33.85 54.17,28.51 53.6,27.95 53.57,27.92
  Bottom 0.203: v53.55,27.94 53.8,28.2 56.07,25.93 56.07,16.38 51.75,12.06 JP3.9
D10  (via drill 0.39)
  Top 0.203: v53.43,28.98 53.43,29.05 51.84,29.05 51.28,29.61 X4.8
  Bottom 0.203: v53.43,28.98 53.69,28.98 56.45,26.22 56.45,16.13 54.29,13.97 JP3.7
D+  (via drill 0.39)
  Top 0.203: X4.67 41.46,26.6 v42.04,27.18 | v42.67,43.24 42.63,43.28 R25.2
  Bottom 0.203: v42.04,27.18 41.78,27.43 41.78,42.35 v42.67,43.24
D+1
  Top 0.203: X6.12 68.05,9.25 67.31,8.51 67.31,2.29 65.41,0.38 30.99,0.38 28.94,2.43 X2.D+
D+2
  Top 0.203: X6.10 67.05,9.33 66.42,8.7 66.42,2.6 64.96,1.14 59.37,1.14 58.78,1.73 X5.D+
D+3  (via drill 0.4)
  Top 0.203: v65.79,9.98 65.92,9.98 66.1,10.16 66.1,11.09 X6.8
  Bottom 0.203: JP3.16 45.55,9.68 65.3,9.68 65.61,9.98 v65.79,9.98
D-  (via drill 0.39)
  Top 0.203: X4.66 v41.06,27.81 | v45.09,44.2 45.09,45.25 R24.2
  Bottom 0.203: v41.06,27.81 41.06,27.2 41.76,26.5 42.32,26.5 42.72,26.9 42.72,27.46 42.16,28.01 42.16,41.66 44.7,44.2 v45.09,44.2
D-1  (via drill 0.39)
  Top 0.203: X6.11 67.55,9.29 66.8,8.54 66.8,2.32 65.25,0.76 31.15,0.76 29.62,2.29 v29.62,3.05
  Bottom 0.203: v29.62,3.05 28.57,3.05 26.8,4.83 26.8,5.17 X2.D-
D-2
  Top 0.203: X5.D- 56.78,5.6 58.23,7.05 59.2,7.05 59.79,6.46 59.79,4.16 59.17,3.54 59.17,1.89 59.53,1.52 64.8,1.52 66.04,2.76 66.04,8.86 66.55,9.37 X6.9
D-3  (via drill 0.4)
  Top 0.203: v65.36,8.99 65.36,9.44 65.1,9.7 65.1,10.26 65.55,10.71 X6.7
  Bottom 0.203: JP3.14 46.67,8.39 47.58,9.3 65.06,9.3 v65.36,8.99
ESP_BUSY  (via drill 0.39, 0.48)
  Top 0.203: X4.80 47.88,25.51 51.16,22.23 v52.83,22.23 | v54.36,16.76 54.36,15.75 51.46,12.86 42.26,12.86 41.78,12.38 28.64,12.38 23.84,17.18 18.71,17.18 v18.55,17.34 | U9.24 18.9,37.45 19.39,36.97 v19.39,36.2 v19.38,36.2
  Bottom 0.203: v54.36,16.76 52.32,18.8 52.32,21.84 52.7,22.23 v52.83,22.23 | v19.38,36.2 18.55,35.37 v18.55,17.34
ESP_CS  (via drill 0.39)
  Top 0.203: X4.57 37.26,28.02 37.25,28.03 32.7,28.03 30.45,25.78 14.73,25.78 12.95,27.56 v12.95,28.19 | U9.16 12.5,35.98 IC1.1 13.24,36.71 v13.4,36.71
  Bottom 0.203: v13.4,36.71 12.95,36.26 v12.95,28.19
ESP_MISO
  Top 0.203: U9.15 11.7,36.11 IC1.2
ESP_TX  (via drill 0.39)
  Top 0.203: v22.32,46.52 21.36,46.52 20.77,45.92 20.77,43.88 20.36,43.47 U9.31 | R28.2 62.65,37.02 v63.2,37.57
  Bottom 0.203: v22.32,46.52 22.76,46.96 34.39,46.96 37.91,50.48 47.85,50.48 53.11,45.22 53.11,39.14 53.94,38.32 62.08,38.32 62.82,37.57 v63.2,37.57
GND  (via drill 0.48)
  Top 0.203: X4.62 39.46,24.37
  Top 0.254: 70.42,28.64 U4.33 | 39.46,24.37 C10.2
  Top 0.305: 61.32,22 60.74,22 60.33,22.42 58.04,22.42 57.59,22.86 v57.59,23.3 | U4.29 69.92,29.14 | 69.92,29.14 U4.33 | U4.20 70.42,28.64 71.42,27.64 71.82,27.64 | U4.18 71.82,27.64 | U4.16 71.92,27.54 71.82,27.64 | U4.14 70.92,28.14 U4.33 | U4.1 68.42,30.64 69.92,29.14 | U4.33 71.31,30.04 v71.31,30.1 71.92,30.71 U4.25 | U5.2 61.78,33.72 62.74,34.67 C44.2 63.5,34.16 64.07,34.16 64.33,33.91 C34.2 | U2.2 57.85,33.72 57.22,34.35 C5.1 | C40.2 6.95,42.67 U9.6 U9.54 | C19.2 8.15,36.87 U9.52 | X1.6 32.06,44.58 v32.38,44.58 | X1.MT2 21.96,51.45 X1.MT1 | U9.51 19.88,37.72 19.43,38.17
  Top 0.406: TP5.P$1 3.81,5.84 1.52,8.13 1.52,8.75 SW1.A | TP4.P$1 81.92,4.25 80.14,6.03 v78.68,6.03 | C54.2 4.06,44.77 4.06,43.27
  other vias: 37.78,21.27 35.94,21.34 47.82,19.94 40.39,30.23 44.32,27.88 45.59,29.72 45.34,31.24 43.43,33.21 42.99,52.32 38.86,40.39 48.51,42.74 47.24,46.04 21.15,47.5 25.21,43.62 35.24,53.15 31.75,39.94 23.94,38.67 30.1,30.99 53.98,22.54 61.09,19.94 53.85,25.65 69.72,27.75 79.63,28.32 80.84,31.94 59.82,30.29 59.82,32.45 57.85,30.29 80.01,21.53 83.69,27.75 66.74,13.14 33.08,25.4 32.45,21.15 44.64,17.84 58.8,47.37 60.26,47.43 61.66,47.43 63.18,47.43 66.17,47.43 45.53,52.26 40.26,52.2 38.1,25.59 21.91,38.35 23.88,36 57.28,17.08 52.64,16.57 9.84,44.96 11.11,46.35 13.59,46.35 15.88,46.35 18.29,46.16 18.41,44.51 18.1,42.74 16.38,39.05 13.72,39.12 11.43,39.05 9.4,39.43 10.48,41.34 9.78,43.37 4.83,39.37 1.02,43.62 0.89,38.29 6.48,47.37 0.83,33.72 2.79,26.48 1.14,18.67 6.03,20.38 6.03,26.61 14.67,30.29 16.32,26.99 71.06,3.43 71.63,0.7 74.23,0.7 54.42,37.34 47.94,22.67 50.16,20.57 10.29,34.61 11.56,33.02 37.02,45.97 73.6,6.67 70.68,6.67 61.21,2.67 56.71,2.67 61.53,12.57 68.07,8.13 69.34,11.11 74.8,9.46 79.44,11.56 33.34,17.46 44.32,14.35 19.18,8.76 19.24,10.16 15.11,10.29 8.7,11.24 10.6,0.83 16.07,0.76 8.89,4.51 1.52,11.56 15.88,21.97 12.89,25.72 20.32,29.21 20.26,22.42 23.24,29.53 27.05,28.83 20,33.34 26.35,33.97 55.37,28.64 55.94,32.7 64.2,37.97 68.96,34.99 64.58,34.29 51.05,50.67 53.59,49.53
  pour Top: 0,47.88 34.1,47.88 34.1,53.98 85.66,53.98 85.66,0 0,0
  pour Bottom: 0,47.88 34.16,47.88 34.16,53.91 85.72,53.91 85.72,53.66 85.66,47.88 85.66,0 0,0
HDMI_TX0+
  Top 0.178: R14.4 60.36,41.76 62,43.4 X7.7
HDMI_TX0-
  Top 0.178: R14.3 61.26,41.83 63,43.57 X7.9
HDMI_TX1+
  Top 0.178: R12.2 57.93,42 58.57,42.63 59.39,42.63 60.5,43.74 X7.4
HDMI_TX1-
  Top 0.178: X7.6 61.5,43.78 59.21,41.49 R12.1
HDMI_TX2+
  Top 0.178: X7.1 59,44.45 56.23,41.68 R12.4
HDMI_TX2-
  Top 0.178: R12.3 57.13,41.87 58.4,43.14 59.27,43.14 60,43.87 X7.3
HDMI_TXC+
  Top 0.178: R14.2 62.06,41.87 63.5,43.31 X7.10
HDMI_TXC-
  Top 0.178: X7.12 64.5,42.78 63.21,41.49 R14.1
HOTPLUG
  Top 0.203: X7.19 68,43.76 69.63,42.13 70.57,42.13 70.74,41.95 70.74,37.55 R16.1
HOTPLUG_3V
  Top 0.203: R18.2 67.21,36.96 68.45,36.96 R16.2
HSTX12
  Top 0.178: R14.8 62.96,39.62 62.95,39.62 62.04,38.72 61.34,38.72 60.55,37.92 59.75,37.92 58.42,36.6 56.4,36.6 50.6,30.81 X4.11
HSTX13
  Top 0.178: X4.12 47.98,31.23 50.52,31.23 56.25,36.96 58.21,36.96 59.53,38.28 60.4,38.28 61.2,39.07 61.59,39.07 62.06,39.54 R14.7
HSTX14
  Top 0.178: R14.6 61.26,39.64 60.61,38.99 60.32,38.99 59.96,38.63 59.32,38.63 58,37.31 56.1,37.31 50.4,31.61 X4.13
HSTX15
  Top 0.178: R14.5 60.36,39.53 59.82,38.99 59.18,38.99 57.86,37.67 55.96,37.67 50.3,32.01 X4.14
HSTX16
  Top 0.178: X4.16 47.98,32.83 48.82,32.83 49.3,33.31 49.3,33.32 54.07,38.09 57.77,38.09 58.83,39.15 R12.8
HSTX17
  Top 0.178: X4.17 47.98,33.23 48.72,33.23 48.95,33.46 48.95,33.47 53.93,38.44 57.37,38.44 57.93,39.01 R12.7
HSTX18
  Top 0.178: X4.18 48.59,33.61 53.78,38.8 57.09,38.8 57.13,38.84 R12.6
HSTX19
  Top 0.178: X4.19 48.48,34.01 53.69,39.21 55.65,39.21 R12.5
I2S_BCLK  (via drill 0.39)
  Top 0.203: v64.97,28.5 65.28,28.5 66.15,27.64 U4.7 | v45.56,38.7 45.81,38.45 44.26,36.9 X4.27
  Bottom 0.203: v64.97,28.5 64.97,30.16 64.59,30.54 64.59,32.06 61.72,34.92 47.69,34.92 46.57,36.05 46.57,37.7 v45.56,38.7
I2S_DIN  (via drill 0.39)
  Top 0.203: U4.5 66.99,28.64 66.55,29.08 v66.42,29.08 | X4.25 45.06,36.62 46.4,37.97 47.51,37.97 v47.89,38.35
  Bottom 0.203: v66.42,29.08 66.1,29.4 66.1,30.29 65.41,30.99 65.41,32.32 62.04,35.69 48.01,35.69 47.51,36.19 47.51,37.97 v47.89,38.35
I2S_ESP_IRQ  (via drill 0.39)
  Top 0.203: X4.23 45.86,36.34 46.6,37.08 v49.07,37.08 | v66.71,35.03 66.78,34.96 66.78,33.23 68.38,31.63 68.38,31.33 U4.32 | U9.23 18.16,37.71 | 18.16,37.71 R27.1 | v18.07,41.38 18.16,41.29 18.16,37.71
  Bottom 0.203: v66.71,35.03 65.29,36.45 51.29,36.45 50.66,37.08 v49.07,37.08 50.72,37.08 52.67,39.02 52.67,40.83 | 52.67,40.83 52.67,45.12 47.74,50.05 38.02,50.05 34.49,46.52 23.47,46.52 21.08,44.13 21.08,44.01 18.46,41.38 v18.07,41.38 | ESP_BOOT.1 52.6,40.89 52.67,40.83
I2S_LRCLK  (via drill 0.39)
  Top 0.203: X4.28 43.86,37.46 v44.67,38.27 | v64.22,29.4 65.14,29.4 66.4,28.14 U4.6
  Bottom 0.203: v44.67,38.27 46.19,36.75 46.19,35.89 47.53,34.54 61.57,34.54 64.16,31.95 64.16,29.46 v64.22,29.4
I2S_MCLK  (via drill 0.39)
  Top 0.203: X4.26 44.66,36.76 46.29,38.39 46.87,38.39 v46.87,38.69 | v65.28,27.44 65.6,27.13 67.56,27.13 67.75,27.13 U4.8
  Bottom 0.203: v46.87,38.69 47,38.55 47,36.16 47.85,35.31 61.88,35.31 65.02,32.16 65.02,30.75 65.67,30.11 65.67,27.82 v65.28,27.44
IRIN
  Top 0.203: O1.3 R32.2
LED  (via drill 0.39, 0.4)
  Top 0.203: R11.1 36.75,47.2 36.73,47.21 35.94,46.42 v35.94,46.16 | X4.37 40.26,37.21 39.81,37.66 36.85,37.66 36.45,38.06 v35.94,38.06 | v49.62,44.83 49.62,44.39 50.34,43.66 R32.1
  Bottom 0.203: v35.94,38.06 36.28,38.06 36.28,46.57 36.53,46.82 | v35.94,46.16 35.94,46.29 36.47,46.82 36.53,46.82 | 36.53,46.82 47.95,46.82 49.49,45.28 49.49,44.96 v49.62,44.83
LX
  Top 0.203: X4.63 39.87,25.5 39.87,25 39.88,25 39.88,20.57 39.07,20.57 L1.P$2
MICDET  (via drill 0.39)
  Top 0.203: v76.9,38.92 77.47,38.92 82.18,43.64 X8.1
  Top 0.254: U4.11 69.42,24.75 70.17,24 72.39,24 v73.22,23.18 72.29,24.11 R22.1
  Bottom 0.203: v73.22,23.18 73.6,23.18 77.22,26.8 77.22,38.73 77.03,38.92 v76.9,38.92
MISO  (via drill 0.39, 0.48)
  Top 0.203: X4.36 40.66,37.35 39.91,38.1 36.99,38.1 35,40.09 v32.83,40.09 | IC1.4 11.56,34.32 12.83,34.32 13.75,35.24 17.53,35.24 17.56,35.28 18.89,35.28 v19.24,34.92 | JP3.20 37.97,9.34 28.32,9.34 27.39,10.26 27.39,11.23 23.37,15.25 v20.51,15.25
  Bottom 0.203: v32.83,40.09 31.94,40.98 31.94,43.94 30.92,44.96 24.54,44.96 22.86,43.28 22.86,41.15 20.32,38.61 20.32,36.01 v19.24,34.92 19.13,34.81 19.13,18.85 20.51,17.46 v20.51,15.25
MISO/SDIO_DAT0  (via drill 0.39)
  Top 0.203: X1.7 33.16,43.42 v33.21,43.37 | v32.51,34.92 32.96,35.37 33.85,35.37 36.44,32.79 37.25,32.79 37.26,32.8 37.75,32.8 X4.45
  Bottom 0.203: v33.21,43.37 33.4,43.37 34.67,42.1 34.67,40.39 33.78,39.5 33.78,36.2 v32.51,34.92
MOSI  (via drill 0.39, 0.48)
  Top 0.203: X4.39 39.45,36.21 39.07,36.6 v37.53,36.6 | v21.73,41.52 20.48,40.27 U9.27 | JP3.18 40.45,9.4 38.45,9.4 38.13,9.72 30.48,9.72 30.04,10.16 30.04,11.56 29.59,12 28.48,12 24,16.48 18.06,16.48 17.4,17.15 v17.4,17.65
  Bottom 0.203: v37.53,36.6 35.16,36.6 34.64,37.12 34.64,39.15 35.5,40.01 35.5,43.85 34.01,45.34 24.32,45.34 22.36,43.38 22.36,42.15 v21.73,41.52 21.24,41.52 18.11,38.39 18.11,18.36 v17.4,17.65
MOSI/SDIO_CMD  (via drill 0.39)
  Top 0.203: X4.44 36.68,33.21 34.09,35.8 28.91,35.8 28.38,36.32 v28.38,36.58 | v28.77,43.88 X1.3
  Bottom 0.203: v28.38,36.58 28.77,36.96 v28.77,43.88
N$1
  Top 0.254: L.C 36.83,50.15 R11.2
N$2
  Top 0.203: ON.A 48.79,48.7 R2.2
N$3
  Top 0.406: LED2.3 3.13,39.51 LED1.1
N$4
  Top 0.254: T1.3 61.3,23.35 PTC1.2
N$5
  Top 0.254: R1.2 57.95,21.25 T1.1 57.85,21.52 56.09,23.29 Q1.3
N$6
  Top 0.203: D3.A 49.09,16.73 R26.2
N$7
  Top 0.203: X6.3 62.74,13.39 62.61,13.53 62.61,14.66 Y2.1
N$8
  Top 0.203: X6.4 62.54,12.89 61.72,13.72 Y2.3
N$9
  Top 0.406: LED1.3 3.13,33.15 LED3.1
N$10
  Top 0.203: Y1.3 44.36,42.99 R23.1 41.78,41.81 C27.2
N$11
  Top 0.406: LED4.1 4.88,26.25 LED3.3
N$12
  Top 0.203: R9.2 58.17,13.63 58.17,7.62 57.66,7.11 56.01,7.11 55.5,6.6 55.5,2.67 54.84,2.01 50.65,2.01 49.29,3.25 49.22,3.31 P2LED.C 48.5,2.79 37.34,2.79 36.82,3.31 P1LED.A
N$13
  Top 0.254: X6.23 66.05,15.72 65.54,16.22 59.06,16.22 R9.1
N$14
  Top 0.203: 66.07,16.64 57.98,16.64 53.09,11.74 53.09,8 51.18,6.1 50.23,6.1 49.02,4.89 | P1LED.C 37.79,5.91 48.07,5.91 49.02,4.95 49.02,4.89 | 49.02,4.89 P2LED.A
  Top 0.254: X6.21 67.05,15.65 66.07,16.64
N$15
  Top 0.406: LED4.3 3.13,21 4.88,19.25 LED5.1
N$16
  Top 0.178: U4.30 69.42,32.59 69.87,33.05 69.87,34.8 | C43.1 72.39,39.37 72.26,39.24
  Top 0.305: 69.87,34.8 69.87,35.07 70.61,35.81 72.26,35.81 72.26,39.24
N$17
  Top 0.254: U4.27 70.92,31.93 72.58,33.59 C42.1
N$18
  Top 0.254: U4.12 69.92,25.82 70.59,25.15 R22.2
N$19
  Bottom 0.203: 13.91,2.03 14.22,2.03
NEOPIX  (via drill 0.39, 0.48)
  Top 0.203: X4.40 39.04,35.69 v38.29,35.69 | v4.7,42.8 4.7,43.93 LED2.1 | v8.26,30.29 8.6,30.63 11.5,30.63 12.33,31.46 16.51,31.46 24.62,31.46 v24.64,31.48
  Bottom 0.203: v38.29,35.69 37.97,35.69 35.18,32.89 26.05,32.89 v24.64,31.48 | v4.7,42.8 4.19,42.8 3.81,42.42 3.81,34.54 8.06,30.29 v8.26,30.29
OUTL
  Top 0.305: X8.6 74.3,37.09 X8.4
  Top 0.406: C42.2 75.12,36.26 74.3,37.09
OUTR
  Top 0.305: X8.3 X8.5
  Top 0.406: X8.5 74.27,43.98 73.44,43.98 72.39,42.93 C43.2
PERIPH_RST  (via drill 0.39)
  Top 0.203: X4.22 46.26,36.2 46.75,36.69 48.07,36.69 v48.38,36.39 | v67.89,34.99 67.87,34.97 67.87,33.85 67.87,32.71 68.92,31.66 U4.31 | U9.8 7.18,41.07 v6.87,40.76 6.67,40.56 R13.1 | v11.3,20.07 11.81,19.56 v25.18,19.56
  Top 0.254: R7.1 67.87,33.85
  Bottom 0.203: v67.89,34.99 67.89,34.67 67.44,34.23 66.55,34.23 64.71,36.07 48.7,36.07 v48.38,36.39 48.2,36.57 48.2,37.25 50.76,39.81 50.76,46.49 47.58,49.67 38.18,49.67 34.65,46.14 23.79,46.14 18.1,40.45 7.18,40.45 v6.87,40.76 6.87,35.3 11.18,30.99 11.18,20.07 v11.3,20.07 | JP3.24 33.15,8.26 31.88,9.53 30.35,9.53 29.97,9.91 29.97,11.3 25.02,16.26 25.02,19.56 v25.18,19.56
PSRAM_CS
  Top 0.203: U3.1 31.67,19.75 R6.1 31.18,19.75 31.18,25.91 32.88,27.61 X4.58
PWR_SWITCH  (via drill 0.48)
  Top 0.254: R10.1 38.54,44.1 Q3.1 38.31,42.72 37.4,41.81 35.94,41.81 35.67,42.09 23.38,42.09 23.37,42.1 20.7,39.43 20.7,34.1 v21.08,33.72
  Bottom 0.203: 27.5,1.97 40.7,1.97 | 25.09,7.14 23.02,7.14
  Bottom 0.254: v21.08,33.72 21.46,33.34 21.46,8.7 23.02,7.14 | SW2.P 42.86,4.13 40.7,1.97 | 25.09,7.14 25.6,6.63 25.6,3.86 27.5,1.97
QSPI_CS
  Top 0.203: U6.1 46.98,13.74 48.16,13.74 48.39,13.97 48.39,14.99 | X4.75 44.66,24.36 45.8,23.23 45.8,19.11 47.94,19.11 48.39,18.67 48.39,14.99 | 48.39,14.99 48.48,14.9 R26.1 50.76,14.9 R17.1
QSPI_DATA[0]
  Top 0.203: X4.72 43.46,23.6 44.6,22.46 44.6,19.84 42.74,17.97 41.91,17.97 41.85,18.03 41.85,17.97 | 41.85,17.97 U6.5 | U3.5 36.72,14.29 37.48,13.53 41.21,13.53 41.85,14.16 41.85,17.97
QSPI_DATA[1]
  Top 0.203: X4.74 44.26,24.11 45.41,22.97 45.41,18.73 47.72,18.73 48.01,18.45 48.01,15.88 47.56,15.43 U6.2 43.08,15.43 42.67,15.02 42.67,13.81 41.62,12.76 28.8,12.76 28.19,13.37 28.19,15.56 29.53,16.89 U3.2
QSPI_DATA[2]
  Top 0.203: X4.73 43.86,23.86 45.01,22.71 45.01,19.7 42.29,16.99 42.29,16.38 | 42.29,16.38 42.29,13.97 41.47,13.14 29.21,13.14 28.64,13.72 28.64,15.18 29.08,15.62 U3.3 | U6.3 42.61,16.7 42.29,16.38
QSPI_DATA[3]
  Top 0.203: X4.70 42.66,23.22 43.84,22.04 43.84,20.25 42.52,18.93 38.33,18.93 38.16,18.76 38.16,16.89 | U6.7 39.18,15.43 38.16,16.45 38.16,16.89 | 38.16,16.89 U3.7
QSPI_SCK
  Top 0.203: X4.71 43.06,23.36 44.22,22.19 44.22,20.09 42.68,18.55 38.68,18.55 38.54,18.41 38.54,17.14 38.99,16.7 U6.6 41.21,16.7 41.4,16.51 41.4,15.11 41.08,14.79 38.69,14.79 38.58,14.9 38.58,14.97 37.92,15.62 37.34,15.62 U3.6
SCK  (via drill 0.39, 0.48)
  Top 0.203: X4.38 39.86,37.07 39.66,37.27 35.76,37.27 35.26,37.77 35.26,38.34 35.32,38.39 v35.32,38.81 | U9.28 20.19,41.07 21.59,42.47 v21.59,42.74 | v26.16,27.94 17.02,27.94 v17.21,28.13
  Bottom 0.203: v35.32,38.81 35.88,39.38 35.88,44.01 34.16,45.72 23.97,45.72 21.59,43.33 v21.59,42.74 21.35,42.74 21.35,42.16 17.73,38.55 17.73,28.65 v17.21,28.13 | JP3.22 35.24,9.53 33.4,9.53 32.64,10.29 32.64,13.59 28.11,18.12 28.11,26.63 26.8,27.94 v26.16,27.94
SCK/SDIO_CLK  (via drill 0.39)
  Top 0.203: X4.43 36.88,33.61 34.1,36.39 32.59,36.39 v32.38,36.6 | v30.86,43.18 30.86,48.45 X1.5
  Bottom 0.203: v32.38,36.6 32.38,37.24 30.86,38.76 v30.86,43.18
SCL  (via drill 0.39)
  Top 0.178: R15.4 67.48,38.77 v67.48,38.2 67.44,38.16 65.09,38.16 64.21,39.04 Q2.1 64.21,39.8 63.31,40.7 54.04,40.7
  Top 0.203: X4.21 49.04,35.71 54.04,40.7 | U4.10 68.92,24.65 70.76,22.81 71.69,22.81 v71.82,22.94 | CONN1.4 74.51,5.07 v74.51,3.43
  Bottom 0.178: v67.48,38.2 67.48,38.62 68.61,39.75
  Bottom 0.203: 68.61,39.75 72.58,39.75 76.45,35.88 76.45,27.11 73.6,24.26 72.45,24.26 71.82,23.62 v71.82,22.94 71.82,21.92 76.55,17.19 76.55,5.27 74.71,3.43 v74.51,3.43 73.75,4.19 71.86,4.19 70.08,5.97 62.78,5.97 61.7,7.05 55.53,7.05 54.32,8.26 JP3.8
SCL_5V
  Top 0.178: Q2.6 64.21,41.6 64.83,42.23 65.11,42.23 | R15.1 67.73,42 67.5,42.23 65.11,42.23 | X7.15 66,43.81 65.11,42.93 65.11,42.23
SD_DETECT
  Top 0.203: X1.CD2 28.64,39.05 32.74,39.05 33.44,38.35 | 33.44,38.35 32.74,38.35 37.09,34.01 X4.42 | 33.44,38.35 X1.CD1
SDA  (via drill 0.39)
  Top 0.178: Q2.4 66.55,41.42 66.78,41.42 67.48,40.72 R15.2
  Top 0.203: v66.55,41.53 66.55,41.42 | U4.9 68.51,26.4 68.51,24.51 70.81,22.21 v72.63,22.21 | v73.53,3.43 73.46,3.5 CONN1.3 | v54.8,39.94 53.88,39.94 48.34,34.41 X4.20
  Bottom 0.203: v54.8,39.94 54.99,39.75 66.19,39.75 67.26,40.82 | 67.26,40.82 67.48,40.59 67.94,40.13 72.74,40.13 76.83,36.03 76.83,26.96 73.75,23.88 72.8,23.88 72.52,23.59 72.52,22.33 v72.63,22.21 72.63,21.7 76.97,17.36 76.97,4.83 74.87,2.73 74.23,2.73 v73.53,3.43 73.15,3.81 71.7,3.81 69.92,5.59 63.45,5.59 62.41,4.55 62.41,3.54 62.29,3.43 55.82,3.43 55.5,3.75 55.5,6.54 54.93,7.11 52.9,7.11 JP3.10 | 67.26,40.82 v66.55,41.53
SDA_5V  (via drill 0.39)
  Top 0.178: Q2.3 65.71,40.06 66.06,40.41 v65.91,40.56 66.65,40.56 67.28,39.92 R15.3 | X7.16 66.5,43.31 v66.17,42.98
  Bottom 0.178: v66.17,42.98 65.79,42.6 65.79,40.95 66.05,40.69 v65.91,40.56
SDCS/SDIO_DAT3  (via drill 0.39)
  Top 0.203: X4.48 35.86,31.61 33.89,33.58 32.3,33.58 30.99,34.88 29.15,34.88 29.15,34.31 29.02,34.31 | v27.88,34.38 27.94,34.31 29.02,34.31 | v27.62,43.75 27.62,45.57 27.66,45.61 X1.2 | R3.1 29.02,34.31
  Bottom 0.203: v27.88,34.38 28.38,34.88 28.38,35.58 27.62,36.34 27.62,36.92 28.38,37.68 28.38,42.99 v27.62,43.75
SDIO_DAT1  (via drill 0.39)
  Top 0.203: X1.8 34.01,48.3 34.01,44.29 v33.97,44.26 | v33.59,34.67 33.97,34.67 36.24,32.41 X4.46
  Bottom 0.203: v33.97,44.26 35.05,43.18 35.05,40.2 34.23,39.37 34.23,35.31 v33.59,34.67
SDIO_DAT2  (via drill 0.39)
  Top 0.203: X4.47 36.05,32.01 34.08,33.98 32.45,33.98 31.05,35.37 v27.62,35.37 | v26.54,43.69 26.56,43.7 X1.1
  Bottom 0.203: v26.54,43.69 26.73,43.69 28,42.41 28,37.91 27.24,37.15 27.24,35.8 27.62,35.42 v27.62,35.37
SPKN  (via drill 0.39, 0.48)
  Top 0.203: U4.19 72.89,28.14 73.47,27.56 74.8,27.56
  Top 0.254: U4.23 72.95,30.14 73.84,31.03 v73.89,31.03 | v74.8,27.5 74.8,27.56 | v75.76,7.26 75.76,7.07 76.45,6.37 76.45,3.11 v76.71,2.86 | v17.84,8.32 17.84,9.83 X9.1
  Bottom 0.254: v73.89,31.03 73.89,30.84 74.49,30.24 74.49,27.81 v74.8,27.5 74.8,26.04 73.43,24.66 72.28,24.66 71.11,23.49 71.11,21.99 76.14,16.96 76.14,7.64 v75.76,7.26 | v76.71,2.86 75.74,1.89 69.25,1.89 68.65,1.29 53.13,1.29 52.79,0.95 20.07,0.95 17.84,3.17 v17.84,8.32
SPKP  (via drill 0.39, 0.48)
  Top 0.254: v72.52,32.13 71.75,32.13 71.42,31.79 U4.26 | U4.22 73.61,29.64 73.79,29.82 v73.79,29.95 | v74.89,8 v74.89,8.01 76.07,8.01 76.89,7.19 76.89,5.22 77.46,4.65 77.46,3.43 v77.78,3.11 | v16.64,8.38 16.64,9.79 X9.2
  Bottom 0.254: v72.52,32.13 72.52,30.73 73.31,29.95 v73.79,29.95 74.06,29.67 74.06,27.16 74.37,26.85 74.37,26.22 73.25,25.09 72.11,25.09 70.68,23.67 70.68,21.81 75.71,16.78 75.71,8.83 v74.89,8 | v77.78,3.11 77.78,2.87 76.37,1.46 69.42,1.46 68.83,0.86 53.31,0.86 52.97,0.52 19.89,0.52 17.21,3.2 17.21,7.81 v16.64,8.38
SWCLK
  Top 0.203: X4.33 41.86,37.77 40.38,39.25 37.55,39.25 35.27,41.53 24.64,41.53 23,39.89 DEBUG.1
SWDIO
  Top 0.203: X4.34 41.46,37.63 40.23,38.87 37.33,38.87 35.05,41.15 25.91,41.15 25,40.24 DEBUG.3
USB_D+
  Top 0.203: X3.A6 43.18,47.77 43.18,48.7 42.99,48.9 42.29,48.9 42.04,48.64 42.04,47.77 X3.B6
  Top 0.254: X3.B6 42.11,45.5 R25.1
USB_D-
  Top 0.203: 42.61,46.35 42.68,46.42 43.62,46.42 43.62,47.69 X3.B7
  Top 0.254: X3.A7 42.61,46.35 42.61,46.07 R24.1
USBBOOT/BUTTON1  (via drill 0.39)
  Top 0.203: 49.09,22.67 48.26,23.5 46.64,23.5 45.46,24.67 X4.77 | 49.09,22.67 49.34,22.42 49.34,22.43 53.93,17.84 55.12,17.84 | 49.09,22.67 D3.C | BTN0.B' 80.85,13.43 80.83,13.24 | 80.83,13.24 80.82,13.43 BTN0.B 75.03,13.43 v71.5,16.95 | 55.12,17.84 61.75,17.84 62.51,17.08 64.39,17.08 v65.14,17.83 | 80.83,13.24 80.71,13.24 v80.64,13.17 | 55.12,17.84 55.12,15.94 51.66,12.48 48.74,12.48 48.07,11.81 48.07,9.4 JP3.12
  Bottom 0.203: v65.14,17.83 70.62,17.83 v71.5,16.95 | TP1.P$1 v80.64,13.17
USBH_D+  (via drill 0.39)
  Top 0.203: X4.78 45.86,24.81 46.8,23.88 48.44,23.88 54.09,18.22 62.46,18.22 62.67,18.01 v62.67,17.88 | X6.15 69.73,12.89 70.74,13.91 JP1.1
  Bottom 0.203: v62.67,17.88 62.67,17.75 63.66,16.76 69.91,16.76 70.74,15.94 JP1.1
USBH_D-  (via drill 0.39)
  Top 0.203: X4.79 46.26,24.95 46.95,24.26 48.59,24.26 54.2,18.65 62.95,18.65 63.84,17.76 v63.97,17.76 | JP1.2 70.54,12.39 X6.14
  Bottom 0.203: v63.97,17.76 63.97,17.57 64.39,17.14 70.07,17.14 72.01,15.21 72.01,13.46 JP1.2
USBH_PWR  (via drill 0.39)
  Top 0.203: X4.9 51.41,30.01 v51.63,30.23 | v53.09,21.08 53.19,21.19 54.33,21.19
  Top 0.254: Q1.1 54.33,21.19 54.52,21 R8.2
  Bottom 0.203: v51.63,30.23 51.63,27.54 52.4,26.77 53.9,26.77 55.12,25.55 55.12,22.1 53.98,20.95 53.21,20.95 v53.09,21.08
V33
  Top 0.305: X6.20 67.55,15.95 66.93,16.57 C29.1 66.7,18.96 C30.1
VBUS  (via drill 0.39, 0.48)
  Top 0.254: X6.19 68.05,15.52 v68.81,15.52 68.11,16.22 | C31.1 63.75,21.78
  Top 0.406: PTC1.1 C9.1 63.44,23.18 C31.1 | 68.11,16.22 68.11,21.78 63.75,21.78 | C32.2 21.54,6.28 21.91,6.35 22.95,5.31 X2.VBUS | v68.58,2.29 C46.2 68.58,3.43 69.47,2.54 75.44,2.54 75.82,2.92 75.82,5.84 73.91,7.75 73.91,13.35 71.27,16 69.29,16 v68.81,15.52
  Bottom 0.406: X2.VBUS 24.44,3.5 26.48,1.46 52.58,1.46 54.28,3.17 X5.VBUS 54.28,1.95 54.43,1.8 68.35,1.8 68.58,2.03 v68.58,2.29
VCC  (via drill 0.48)
  Top 0.406: SENSE1.2 13.46,6.96 v13.46,4.06
  Bottom 0.406: v13.46,4.06 13.4,4 13.4,2.16 SJ1.2
VREG_AVDD
  Top 0.203: X4.61 37.71,24.15 C4.1 37.59,24.22 R5.2
VUSB
  Top 0.305: X3.A4B9 45.29,47.72 45.29,48.21 43.65,49.85 42.08,49.85 40.46,48.23 X3.B4A9 40.46,46.94 38.74,45.22
  Top 0.508: 38.74,45.22 37.59,45.22 36.74,44.38 R10.2 36.74,42.82 Q3.2
XIN
  Top 0.203: X4.30 43.06,38.37 45.9,41.21 45.9,41.28 Y1.1 C26.2
XOUT
  Top 0.203: X4.31 42.66,37.35 42.66,37.36 42.66,39.58 R23.2

## Text on the board
tNames: SCL | SDA | AREF | GND | 1 | ANALOG IN | IOREF | RESET | 3V3 | 5V | GND | VIN | A0 | A1 | A2 | A3 | A4 | A5
Pinguin_tBackup: MicroSD | L | ON | 23 | 22 | Stereo / Headphone | IR In | DVI Video | SWD Debug | #23 | NeoPixels | Fruit Jam / RP2350 / Mini Comp | Button #3 | RP2350 | 4-8Ω | Button #2 | 6- / 20V | Speaker | GND | 5V | 3V | GND | A1 | A2 | A3 | A4 | A5 | D6 | D7 | D9 | 10 | 3V | 5V | D8 | UF2 | Reset | Button #1 | DC | In | A0 | OFF | ON | I2C
Pinguin_bBackup: A RP2350-Based Microcomputer / Jam Packed with Hardware... / 16MB Flash+8MB PSRAM / DVI Video, 2x USB Host / I2S Speaker/Headphone / MicroSD Storage, IR Sensor / ESP32-C6 WiFi Co-Processor / 5x NeoPixels, 3x Buttons / On/Off Switch, GPIO Header / SWD Debug, Stemma QT I2C Port | JST / VCC | 3V | 5V
214bmp: D:/SmartProjects/Snc/a4_bn_logo2.bmp